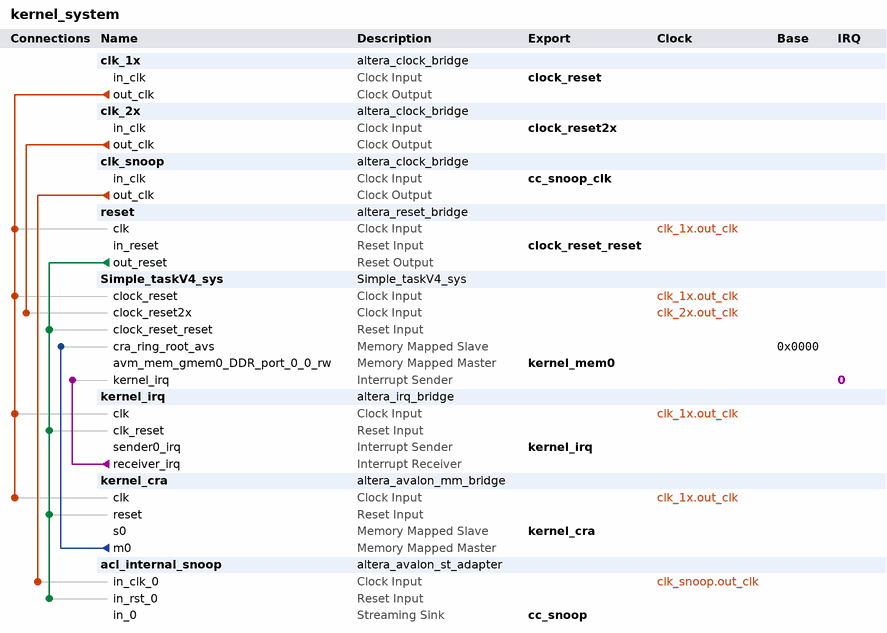
[diagram p0: system contents]
# Platform Designer (Qsys) system kernel_system, Arria 10 10AS016C3U19E2LG
# Parameters at their usual value, and those the tool derives, are not listed.
package require -exact qsys 1.0
create_system kernel_system
set_project_property DEVICE_FAMILY {Arria 10}
set_project_property DEVICE 10AS016C3U19E2LG

add_component clk_1x ip/kernel_system/kernel_system_clk_1x.ip altera_clock_bridge clk_1x 19.2.0

add_component clk_2x ip/kernel_system/kernel_system_clk_2x.ip altera_clock_bridge clk_2x 19.2.0

add_component clk_snoop ip/kernel_system/kernel_system_clk_snoop.ip altera_clock_bridge clk_snoop 19.2.0

add_component reset ip/kernel_system/kernel_system_reset.ip altera_reset_bridge reset 19.2.0

add_component Simple_taskV4_sys ip/kernel_system/kernel_system_Simple_taskV4_sys.ip Simple_taskV4_sys Simple_taskV4_sys 14.0

add_component kernel_irq ip/kernel_system/kernel_system_kernel_irq.ip altera_irq_bridge kernel_irq 19.2.0

add_component kernel_cra ip/kernel_system/kernel_system_kernel_cra.ip altera_avalon_mm_bridge kernel_cra 20.0.1

add_component acl_internal_snoop ip/kernel_system/kernel_system_acl_internal_snoop.ip altera_avalon_st_adapter acl_internal_snoop 19.2.0

# connections
add_connection clk_1x.out_clk kernel_cra.clk clock
add_connection clk_1x.out_clk kernel_irq.clk clock
add_connection clk_1x.out_clk reset.clk clock
add_connection clk_1x.out_clk Simple_taskV4_sys.clock_reset clock
add_connection clk_2x.out_clk Simple_taskV4_sys.clock_reset2x clock
add_connection clk_snoop.out_clk acl_internal_snoop.in_clk_0 clock
add_connection reset.out_reset acl_internal_snoop.in_rst_0 reset
add_connection reset.out_reset kernel_cra.reset reset
add_connection reset.out_reset kernel_irq.clk_reset reset
add_connection reset.out_reset Simple_taskV4_sys.clock_reset_reset reset
add_connection kernel_cra.m0 Simple_taskV4_sys.cra_ring_root_avs avalon
set_connection_parameter_value kernel_cra.m0/Simple_taskV4_sys.cra_ring_root_avs baseAddress 0x0000
add_connection kernel_irq.receiver_irq Simple_taskV4_sys.kernel_irq interrupt
set_connection_parameter_value kernel_irq.receiver_irq/Simple_taskV4_sys.kernel_irq irqNumber 0

# exported interfaces
add_interface cc_snoop avalon_streaming sink
set_interface_property cc_snoop EXPORT_OF acl_internal_snoop.in_0
add_interface cc_snoop_clk clock sink
set_interface_property cc_snoop_clk EXPORT_OF clk_snoop.in_clk
add_interface clock_reset clock sink
set_interface_property clock_reset EXPORT_OF clk_1x.in_clk
add_interface clock_reset2x clock sink
set_interface_property clock_reset2x EXPORT_OF clk_2x.in_clk
add_interface clock_reset_reset reset sink
set_interface_property clock_reset_reset EXPORT_OF reset.in_reset
add_interface kernel_cra avalon slave
set_interface_property kernel_cra EXPORT_OF kernel_cra.s0
add_interface kernel_irq interrupt sender
set_interface_property kernel_irq EXPORT_OF kernel_irq.sender0_irq
add_interface kernel_mem0 avalon master
set_interface_property kernel_mem0 EXPORT_OF Simple_taskV4_sys.avm_mem_gmem0_DDR_port_0_0_rw

save_system kernel_system.qsys
